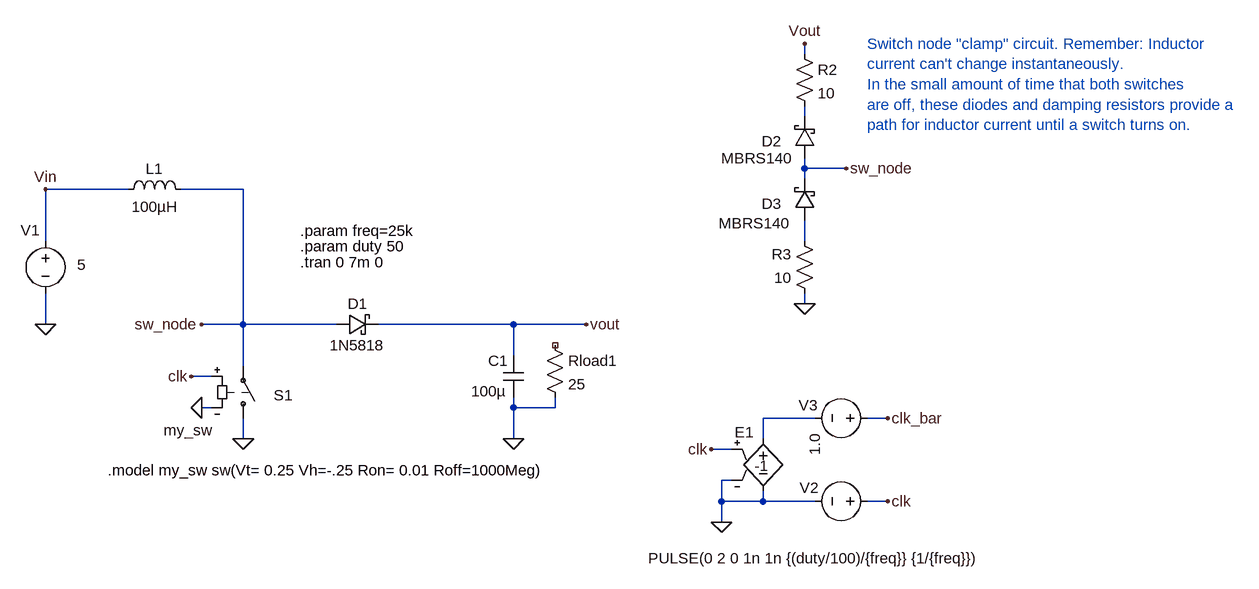
[diagram p0: schematic OL_Boost_concept_schottky.asc]
OL_Boost_concept_schottky.asc, the LTspice schematic file:
Version 4
SHEET 1 1852 680
WIRE 816 -304 816 -320
WIRE 816 -208 816 -224
WIRE 816 -128 816 -144
WIRE 880 -128 816 -128
WIRE 816 -112 816 -128
WIRE -224 -96 -352 -96
WIRE -48 -96 -144 -96
WIRE -352 -16 -352 -96
WIRE 816 -16 816 -48
WIRE 816 80 816 64
WIRE -352 112 -352 64
WIRE -48 112 -48 -96
WIRE -48 112 -112 112
WIRE 96 112 -48 112
WIRE 368 112 160 112
WIRE 480 112 368 112
WIRE 368 160 368 112
WIRE -48 176 -48 112
WIRE -96 192 -128 192
WIRE -96 240 -112 240
WIRE 368 240 368 224
WIRE 432 240 432 224
WIRE 432 240 368 240
WIRE 832 256 752 256
WIRE 944 256 912 256
WIRE -48 288 -48 256
WIRE 368 288 368 240
WIRE 752 288 752 256
WIRE 704 304 672 304
WIRE 704 352 688 352
WIRE 688 384 688 352
WIRE 752 384 752 368
WIRE 752 384 688 384
WIRE 832 384 752 384
WIRE 944 384 912 384
WIRE 688 416 688 384
FLAG -352 112 0
FLAG -352 -96 Vin
FLAG 368 288 0
FLAG -112 240 0
FLAG -48 288 0
FLAG 480 112 vout
FLAG -128 192 clk
FLAG 944 384 clk
FLAG 688 416 0
FLAG 672 304 clk
FLAG 944 256 clk_bar
FLAG 816 -320 Vout
FLAG 816 80 0
FLAG 880 -128 sw_node
FLAG -112 112 sw_node
SYMBOL voltage -352 -32 R0
WINDOW 123 0 0 Left 2
WINDOW 39 0 0 Left 2
WINDOW 0 -38 -1 Left 2
WINDOW 3 49 52 Left 2
SYMATTR InstName V1
SYMATTR Value 5
SYMBOL cap 352 160 R0
WINDOW 0 -23 8 Left 2
WINDOW 3 -49 55 Left 2
SYMATTR InstName C1
SYMATTR Value 100µ
SYMBOL res 416 128 R0
SYMATTR InstName Rload1
SYMATTR Value 25
SYMBOL ind -240 -80 R270
WINDOW 0 32 56 VTop 2
WINDOW 3 5 56 VBottom 2
SYMATTR InstName L1
SYMATTR Value 100µH
SYMBOL sw -48 272 M180
WINDOW 0 47 51 Left 2
WINDOW 3 -47 -3 Right 2
SYMATTR InstName S1
SYMATTR Value my_sw
SYMBOL voltage 928 384 R90
WINDOW 123 0 0 Left 2
WINDOW 39 0 0 Left 2
WINDOW 3 88 -163 VRight 2
WINDOW 0 -21 90 VRight 2
SYMATTR Value PULSE(0 2 0 1n 1n {(duty/100)/{freq}} {1/{freq}})
SYMATTR InstName V2
SYMBOL e 752 272 R0
WINDOW 0 -44 6 Left 2
WINDOW 3 -13 57 Left 2
SYMATTR InstName E1
SYMATTR Value -1
SYMBOL voltage 928 256 R90
WINDOW 123 0 0 Left 2
WINDOW 39 0 0 Left 2
WINDOW 0 -20 92 VRight 2
SYMATTR InstName V3
SYMATTR Value 1.0
SYMBOL schottky 96 128 R270
WINDOW 0 32 32 VTop 2
WINDOW 3 0 32 VBottom 2
SYMATTR InstName D1
SYMATTR Value 1N5818
SYMATTR Description Diode
SYMATTR Type diode
SYMBOL schottky 832 -144 R180
WINDOW 0 51 26 Left 2
WINDOW 3 35 0 Left 2
SYMATTR InstName D2
SYMATTR Value MBRS140
SYMATTR Description Diode
SYMATTR Type diode
SYMBOL res 800 -320 R0
SYMATTR InstName R2
SYMATTR Value 10
SYMBOL res 832 80 R180
WINDOW 0 36 76 Left 2
WINDOW 3 36 40 Left 2
SYMATTR InstName R3
SYMATTR Value 10
SYMBOL schottky 832 -48 R180
WINDOW 0 51 26 Left 2
WINDOW 3 39 -4 Left 2
SYMATTR InstName D3
SYMATTR Value MBRS140
SYMATTR Description Diode
SYMATTR Type diode
TEXT 40 -32 Left 2 !.param freq=25k
TEXT 40 16 Left 2 !.tran 0 7m 0
TEXT -256 336 Left 2 !.model my_sw sw(Vt= 0.25 Vh=-.25 Ron= 0.01 Roff=1000Meg)
TEXT 912 -320 Left 2 ;Switch node "clamp" circuit. Remember: Inductor\ncurrent can't change instantaneously.\nIn the small amount of time that both switches\nare off, these diodes and damping resistors provide a\npath for inductor current until a switch turns on.
TEXT 40 -8 Left 2 !.param duty 50

The netlist it stands for:
* OL_Boost_concept_schottky.asc
V1 Vin 0 5
C1 vout 0 100µ
Rload1 NC_01 0 25
L1 Vin sw_node 100µH
S1 0 sw_node clk 0 my_sw
V2 clk 0 PULSE(0 2 0 1n 1n {(duty/100)/{freq}} {1/{freq}})
E1 N003 0 clk 0 -1
V3 clk_bar N003 1.0
D1 sw_node vout 1N5818
D2 sw_node N001 MBRS140
R2 vout N001 10
R3 0 N002 10
D3 N002 sw_node MBRS140
.model D D
.lib standard.dio
.param freq=25k
.tran 0 7m 0
.model my_sw sw(Vt= 0.25 Vh=-.25 Ron= 0.01 Roff=1000Meg)
* Switch node "clamp" circuit. Remember: Inductor
* current can't change instantaneously.
* In the small amount of time that both switches
* are off, these diodes and damping resistors provide a
* path for inductor current until a switch turns on.
.param duty 50
.backanno
.end